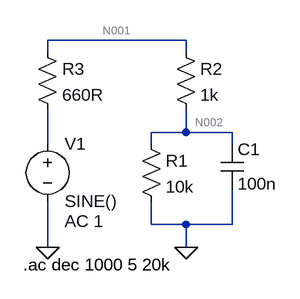
[diagram p0: schematic Draft2.asc]
Draft2.asc, the LTspice schematic file:
Version 4
SHEET 1 880 680
WIRE 224 16 32 16
WIRE 32 32 32 16
WIRE 224 32 224 16
WIRE 224 144 224 112
WIRE 224 144 176 144
WIRE 288 144 224 144
WIRE 32 160 32 112
WIRE 176 160 176 144
WIRE 288 160 288 144
WIRE 176 272 176 240
WIRE 224 272 176 272
WIRE 288 272 288 224
WIRE 288 272 224 272
WIRE 32 304 32 240
WIRE 224 304 224 272
FLAG 224 304 0
FLAG 32 304 0
SYMBOL res 160 144 R0
SYMATTR InstName R1
SYMATTR Value 10k
SYMBOL res 208 16 R0
SYMATTR InstName R2
SYMATTR Value 1k
SYMBOL res 16 16 R0
SYMATTR InstName R3
SYMATTR Value 660R
SYMBOL cap 272 160 R0
SYMATTR InstName C1
SYMATTR Value 100n
SYMBOL voltage 32 144 R0
WINDOW 123 24 124 Left 2
WINDOW 39 0 0 Left 0
SYMATTR InstName V1
SYMATTR Value SINE()
SYMATTR Value2 AC 1
TEXT -2 328 Left 2 !.ac dec 1000 5 20k

The netlist it stands for:
* Draft2.asc
R1 N002 0 10k
R2 N001 N002 1k
R3 N001 N003 660R
C1 N002 0 100n
V1 N003 0 SINE() AC 1
.ac dec 1000 5 20k
.backanno
.end

* Results of the author's LTspice run, read from the files saved beside the schematic
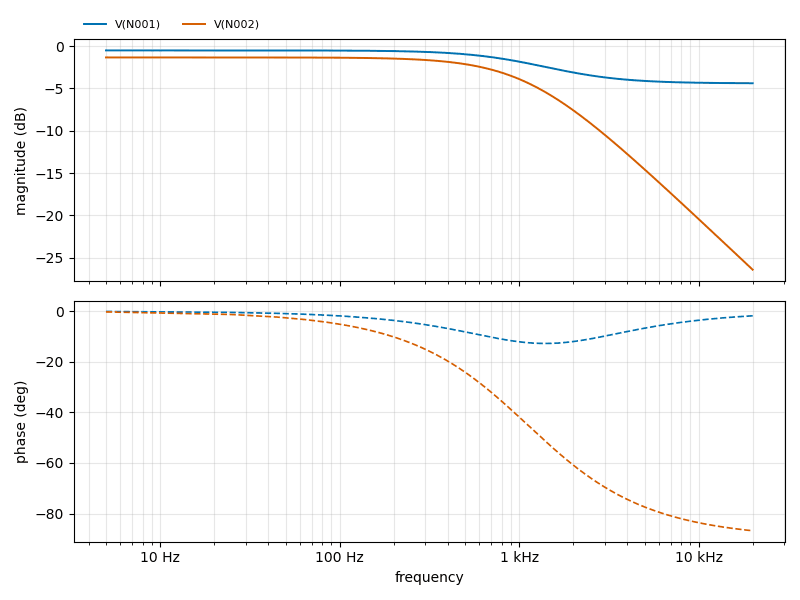
[diagram p1: AC Analysis of Draft2.asc, plotted from the saved traces]
* AC Analysis, 1 run:
*   V(N001): -0.51 dB at 5 Hz, -4.38 dB at 20 kHz, peak -0.51 dB at 5 Hz, 3 dB below the peak at 2.603 kHz
*   V(N002): -1.33 dB at 5 Hz, -26.40 dB at 20 kHz, peak -1.33 dB at 5 Hz, 3 dB below the peak at 1.118 kHz